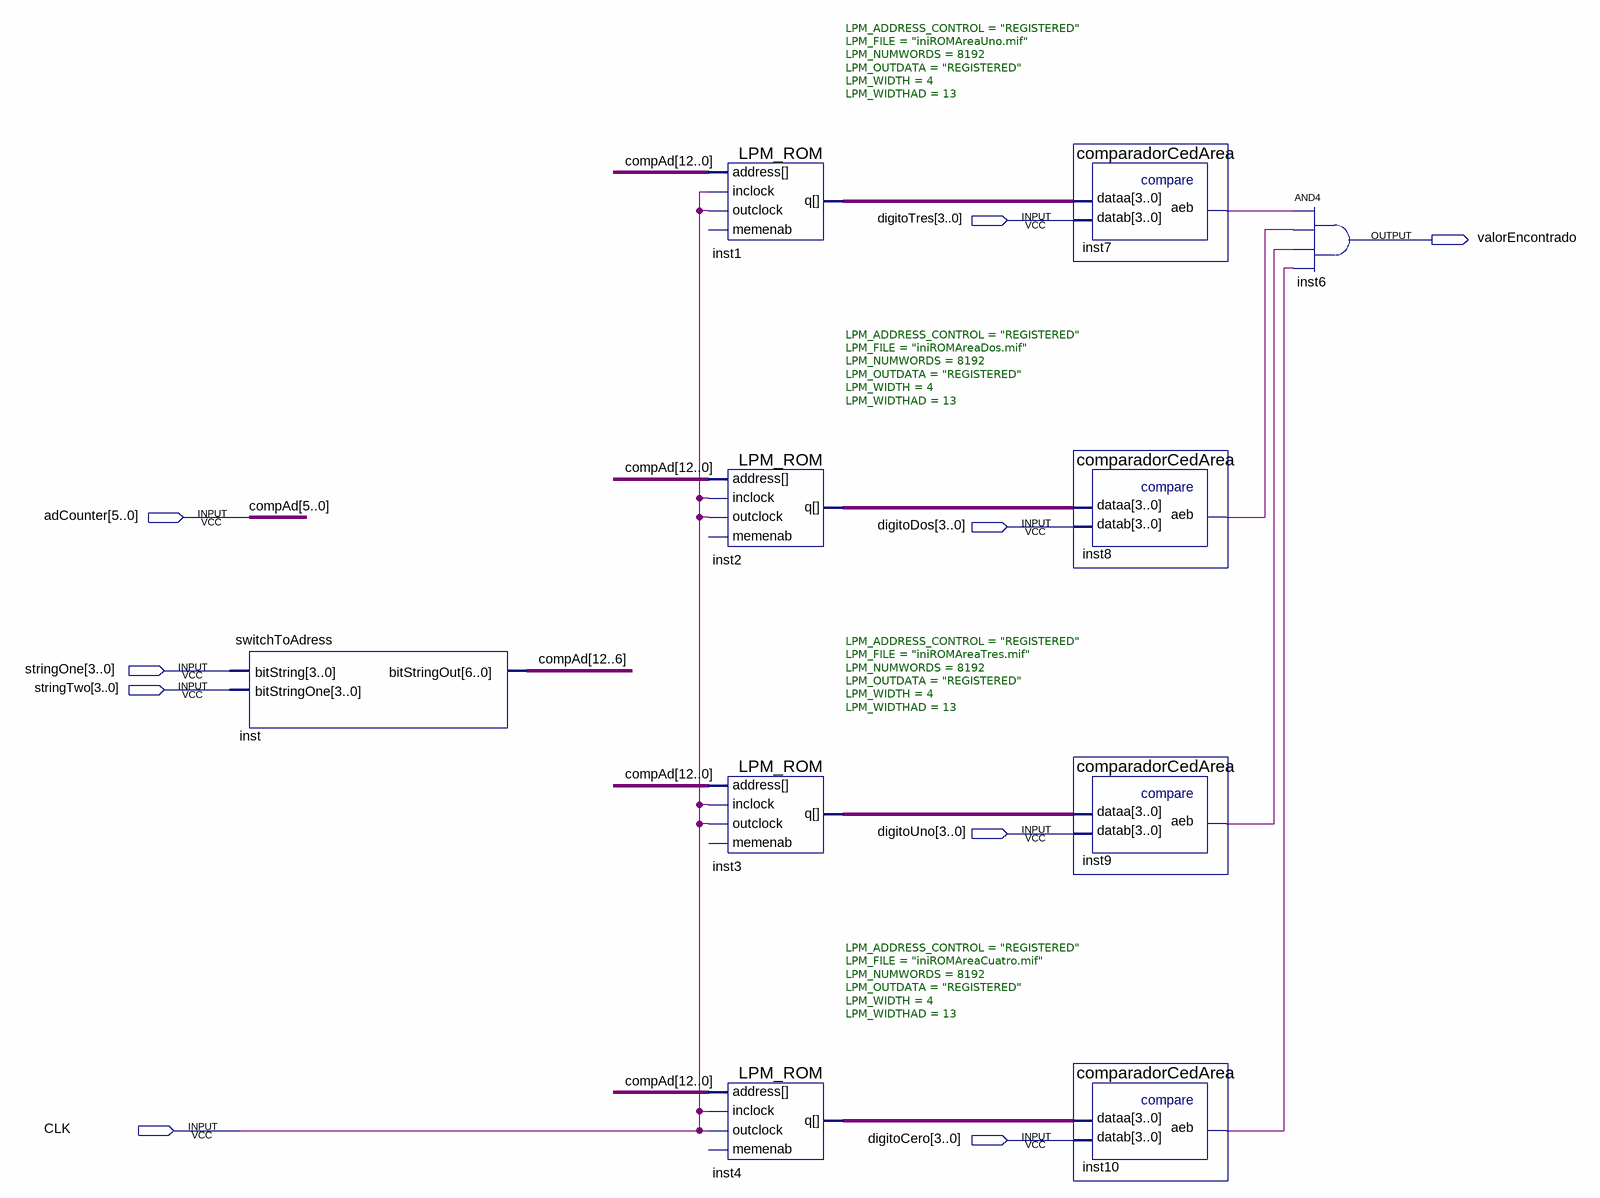
[diagram p0: schematic sheet]
// Quartus schematic ROMCedArea.bdf as structural Verilog: 10 symbols, 9 pins
module ROMCedArea (
  input  [3:0] digitoTres,
  input  [5:0] adCounter,
  input  [3:0] digitoDos,
  input  [3:0] stringOne,
  input  [3:0] stringTwo,
  input  [3:0] digitoUno,
  input  CLK,
  input  [3:0] digitoCero,
  output valorEncontrado
);

  wire inst7_aeb, inst8_aeb, inst9_aeb, inst10_aeb;
  wire [3:0] inst1_q, inst2_q, inst3_q, inst4_q;
  wire [12:6] compAd;

  switchToAdress inst (.bitString(stringOne), .bitStringOne(stringTwo), .bitStringOut(compAd));
  LPM_ROM #(.LPM_ADDRESS_CONTROL("REGISTERED"), .LPM_FILE("iniROMAreaUno.mif"), .LPM_NUMWORDS(8192), .LPM_OUTDATA("REGISTERED"), .LPM_WIDTH(4), .LPM_WIDTHAD(13)) inst1 (
    .address({compAd, adCounter}), .inclock(CLK), .outclock(CLK), .q(inst1_q));  // open: memenab
  LPM_ROM #(.LPM_ADDRESS_CONTROL("REGISTERED"), .LPM_FILE("iniROMAreaDos.mif"), .LPM_NUMWORDS(8192), .LPM_OUTDATA("REGISTERED"), .LPM_WIDTH(4), .LPM_WIDTHAD(13)) inst2 (
    .address({compAd, adCounter}), .inclock(CLK), .outclock(CLK), .q(inst2_q));  // open: memenab
  LPM_ROM #(.LPM_ADDRESS_CONTROL("REGISTERED"), .LPM_FILE("iniROMAreaTres.mif"), .LPM_NUMWORDS(8192), .LPM_OUTDATA("REGISTERED"), .LPM_WIDTH(4), .LPM_WIDTHAD(13)) inst3 (
    .address({compAd, adCounter}), .inclock(CLK), .outclock(CLK), .q(inst3_q));  // open: memenab
  LPM_ROM #(.LPM_ADDRESS_CONTROL("REGISTERED"), .LPM_FILE("iniROMAreaCuatro.mif"), .LPM_NUMWORDS(8192), .LPM_OUTDATA("REGISTERED"), .LPM_WIDTH(4), .LPM_WIDTHAD(13)) inst4 (
    .address({compAd, adCounter}), .inclock(CLK), .outclock(CLK), .q(inst4_q));  // open: memenab
  comparadorCedArea inst7 (.dataa(inst1_q), .datab(digitoTres), .aeb(inst7_aeb));
  comparadorCedArea inst8 (.dataa(inst2_q), .datab(digitoDos), .aeb(inst8_aeb));
  comparadorCedArea inst9 (.dataa(inst3_q), .datab(digitoUno), .aeb(inst9_aeb));
  comparadorCedArea inst10 (.dataa(inst4_q), .datab(digitoCero), .aeb(inst10_aeb));
  and inst6 (valorEncontrado, inst7_aeb, inst8_aeb, inst9_aeb, inst10_aeb);

  // Other names for the same wires on the sheet: compAd[5:0] = adCounter
endmodule
